# EAGLE design Fogger Sheild (EAGLE 6.4)
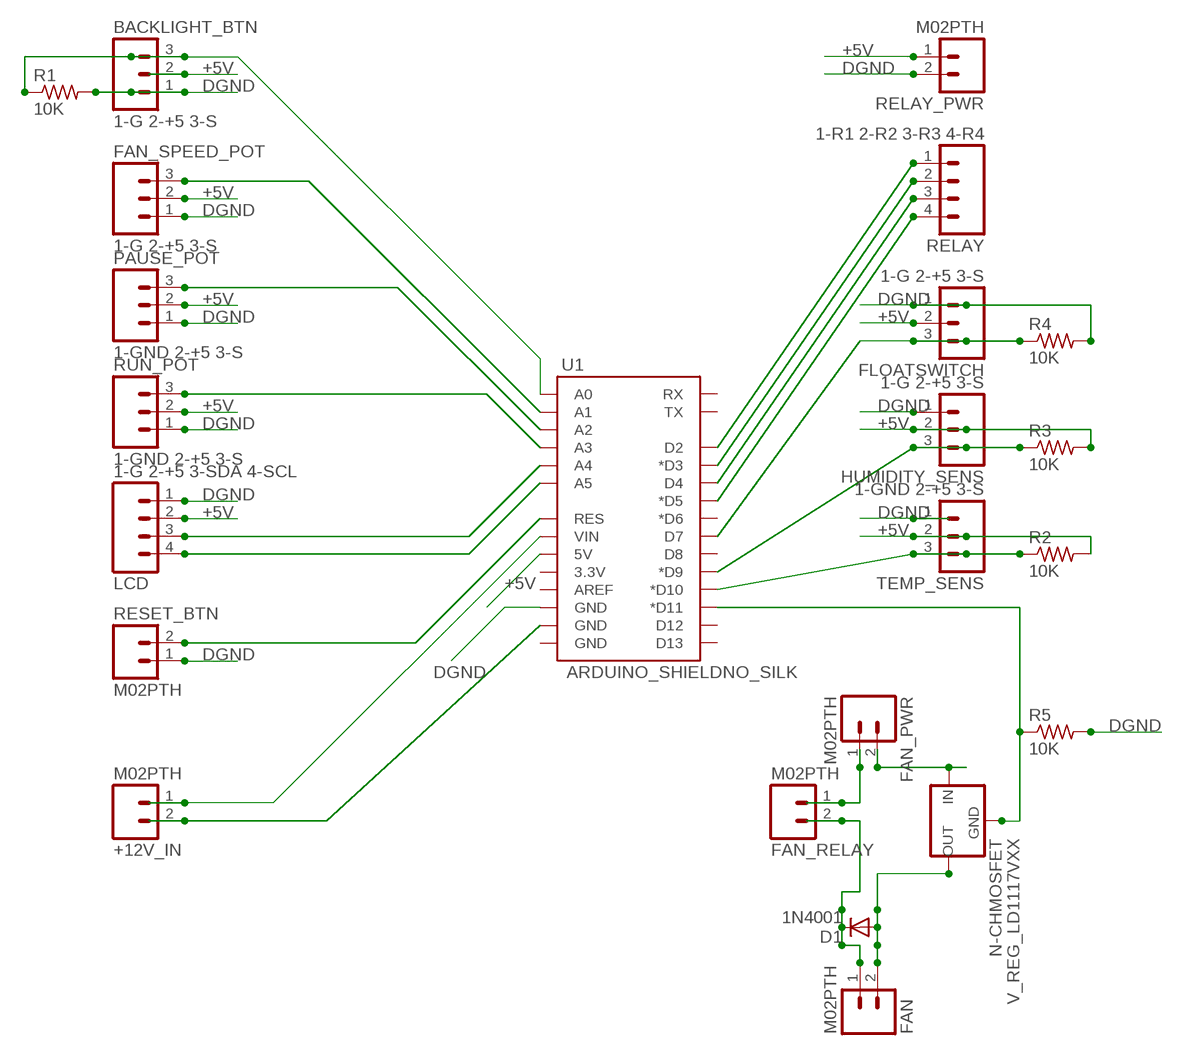
[diagram p0: schematic, sheet 1]

## Parts
+12V_IN  M02PTH  [1X02]
BACKLIGHT_BTN  1-G 2-+5 3-S  M03LOCK  [1X03_LOCK]
D1  1N4001  DIODEPTH  [DIODE-1N4001]
FAN  M02PTH  [1X02]
FAN_PWR  M02PTH  [1X02]
FAN_RELAY  M02PTH  [1X02]
FAN_SPEED_POT  1-G 2-+5 3-S  M03PTH  [1X03]
FLOATSWITCH  1-G 2-+5 3-S  M03LOCK  [1X03_LOCK]
HUMIDITY_SENS  1-G 2-+5 3-S  M03PTH  [1X03]
LCD  1-G 2-+5 3-SDA 4-SCL  M04PTH  [1X04]
N-CHMOSFET  V_REG_LD1117VXX  [78XXL]
PAUSE_POT  1-GND 2-+5 3-S  M03LOCK  [1X03_LOCK]
R1  10K  R-US_0204/5  [0204/5]
R2  10K  R-US_0204/2V  [0204V]
R3  10K  R-US_0204/2V  [0204V]
R4  10K  R-US_0204/5  [0204/5]
R5  10K  R-US_0204/2V  [0204V]
RELAY  1-R1 2-R2 3-R3 4-R4  M04PTH  [1X04]
RELAY_PWR  M02PTH  [1X02]
RESET_BTN  M02PTH  [1X02]
RUN_POT  1-GND 2-+5 3-S  M03PTH  [1X03]
TEMP_SENS  1-GND 2-+5 3-S  M03LOCK  [1X03_LOCK]
U1  ARDUINO_SHIELDNO_SILK  [DUEMILANOVE_VIAS]

## Nets
+5V: BACKLIGHT_BTN.2 FAN_SPEED_POT.2 FLOATSWITCH.2 HUMIDITY_SENS.2 LCD.2 PAUSE_POT.2 R2.2 R3.2 RELAY_PWR.1 RUN_POT.2 TEMP_SENS.2 U1.5V
DGND: BACKLIGHT_BTN.1 FAN_SPEED_POT.1 FLOATSWITCH.1 HUMIDITY_SENS.1 LCD.1 PAUSE_POT.1 R1.2 R4.2 R5.2 RELAY_PWR.2 RESET_BTN.1 RUN_POT.1 TEMP_SENS.1 U1.GND@2(GND)
N$1: RELAY.4 U1.D5(*D5)
N$2: RELAY.3 U1.D4
N$3: RELAY.2 U1.D3(*D3)
N$4: RELAY.1 U1.D2
N$5: LCD.3 U1.A4
N$6: LCD.4 U1.A5
N$7: RUN_POT.3 U1.A3
N$8: PAUSE_POT.3 U1.A2
N$9: FAN_SPEED_POT.3 U1.A1
N$10: +12V_IN.2 U1.GND@1(GND)
N$11: RESET_BTN.2 U1.RES
N$13: +12V_IN.1 U1.VIN
N$14: BACKLIGHT_BTN.3 R1.1 U1.A0
N$18: FLOATSWITCH.3 R4.1 U1.D7
N$19: HUMIDITY_SENS.3 R3.1 U1.D9(*D9)
N$23: R2.1 TEMP_SENS.3 U1.D10(*D10)
N$25: N-CHMOSFET.IN(GND) R5.1 U1.D11(*D11)
N$26: FAN_PWR.2 N-CHMOSFET.OUT(IN)
N$27: D1.A FAN.2 N-CHMOSFET.GND(OUT)
N$28: D1.C FAN.1 FAN_RELAY.2
N$29: FAN_PWR.1 FAN_RELAY.1
Unconnected: U1.3.3V U1.AREF U1.D6(*D6) U1.D8 U1.D12 U1.D13 U1.GND@0(GND) U1.RX U1.TX

## Library data of the parts
+12V_IN FAN FAN_PWR FAN_RELAY RELAY_PWR RESET_BTN = SparkFun-Connectors:M02: Standard 2-pin 0.1" header. Use with - straight break away headers ( PRT-00116) - right angle break away headers (PRT-00553) - swiss pins (PRT-00743) - machine pins (PRT-00117) - female headers (PRT-00115) Molex polarized connector foot print use with: PRT-08233 with associated crimp pins and housings. 2.54_SCREWTERM for use with PRT-10571. 3.5mm Screw Terminal footprints for PRT-08084 5mm Screw Terminal footprints for use with PRT-08433
BACKLIGHT_BTN FAN_SPEED_POT FLOATSWITCH HUMIDITY_SENS PAUSE_POT RUN_POT TEMP_SENS = SparkFun-Connectors:M03: Header 3 Standard 3-pin 0.1" header. Use with straight break away headers (SKU : PRT-00116), right angle break away headers (PRT-00553), swiss pins (PRT-00743), machine pins (PRT-00117), and female headers (PRT-00115). Molex polarized connector foot print use with SKU : PRT-08232 with associated crimp pins and housings.
D1 = SparkFun-DiscreteSemi:DIODE: Diode These are standard reverse protection diodes and small signal diodes. SMA package can handle up to about 1A. SOD-323 can handle about 200mA. What the SOD-323 package when ordering, there are some mfgs out there that are 5-pin packages.
LCD RELAY = SparkFun-Connectors:M04: Header 4 Standard 4-pin 0.1" header. Use with straight break away headers (SKU : PRT-00116), right angle break away headers (PRT-00553), swiss pins (PRT-00743), machine pins (PRT-00117), and female headers (PRT-00115). Molex polarized connector foot print use with SKU : PRT-08231 with associated crimp pins and housings. 1MM SMD Version SKU: PRT-10208
N-CHMOSFET = SparkFun-PowerIC:V_REG_LD1117VXX: LD1117VXX voltage regulator. We carry the 3.3V version (COM-00526) in TO-220 package.
R1-R5 = resistor:R-US_: RESISTOR, American symbol
U1 = SparkFun-Boards:ARDUINO_SHIELD: Arduino shield footprint

## Board
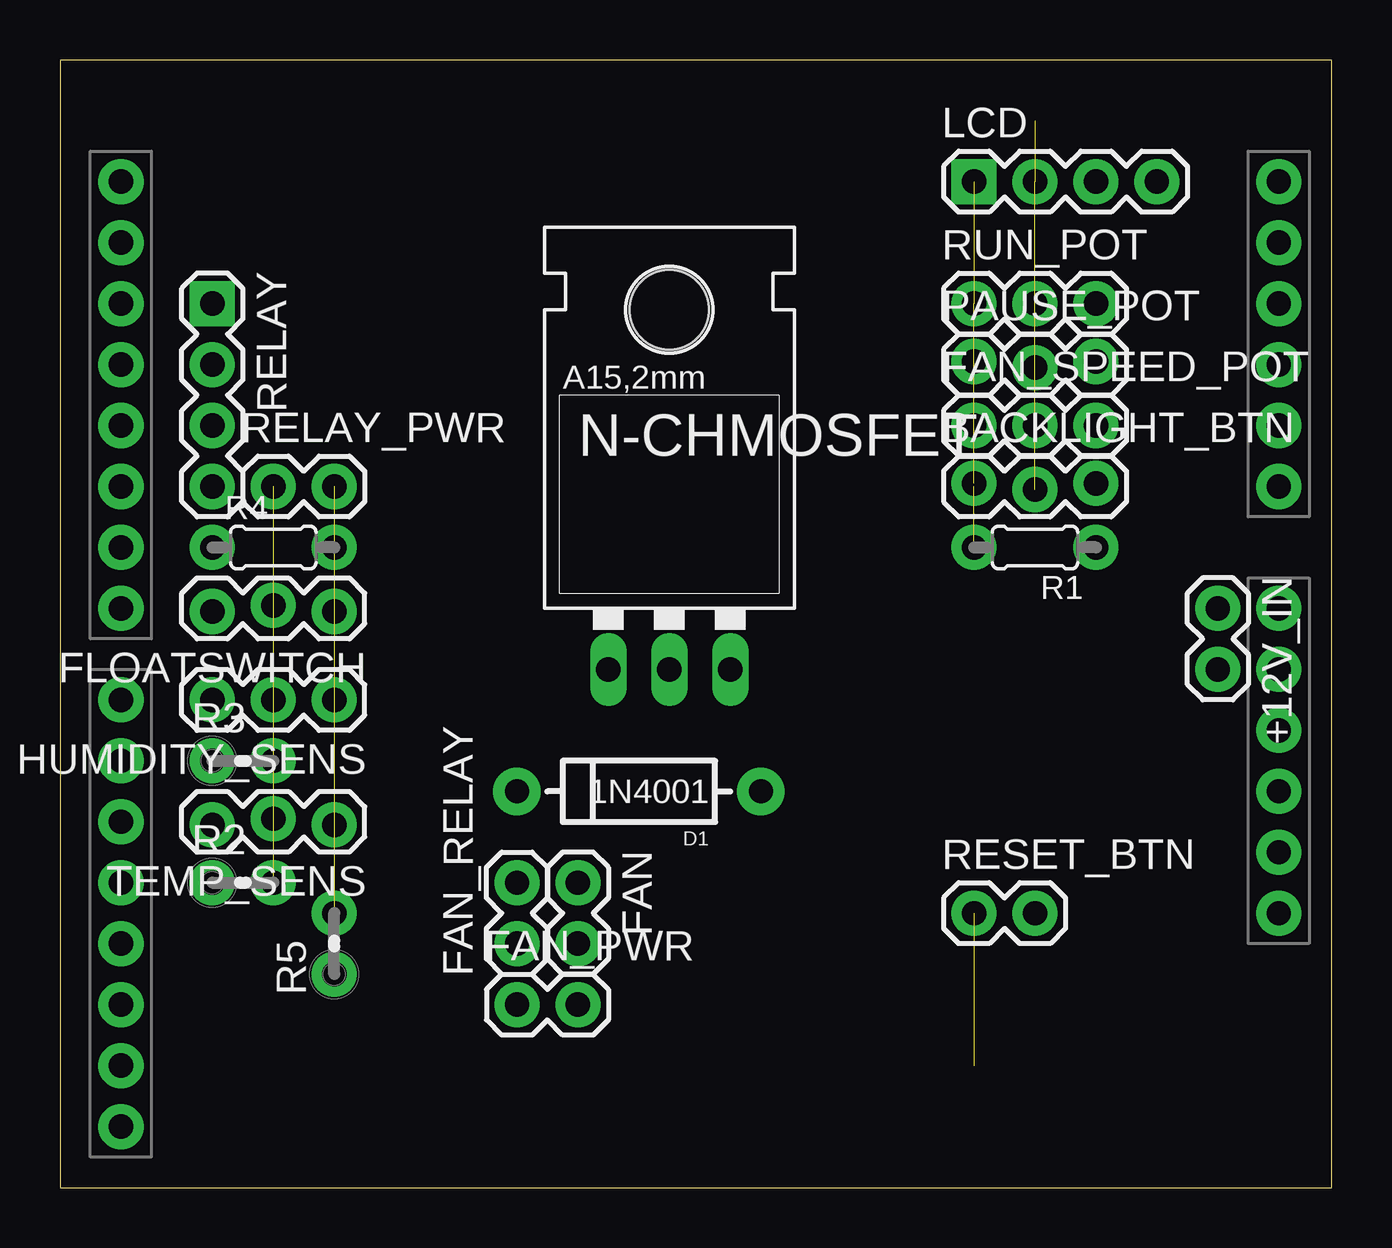
[diagram p1: board, top side]
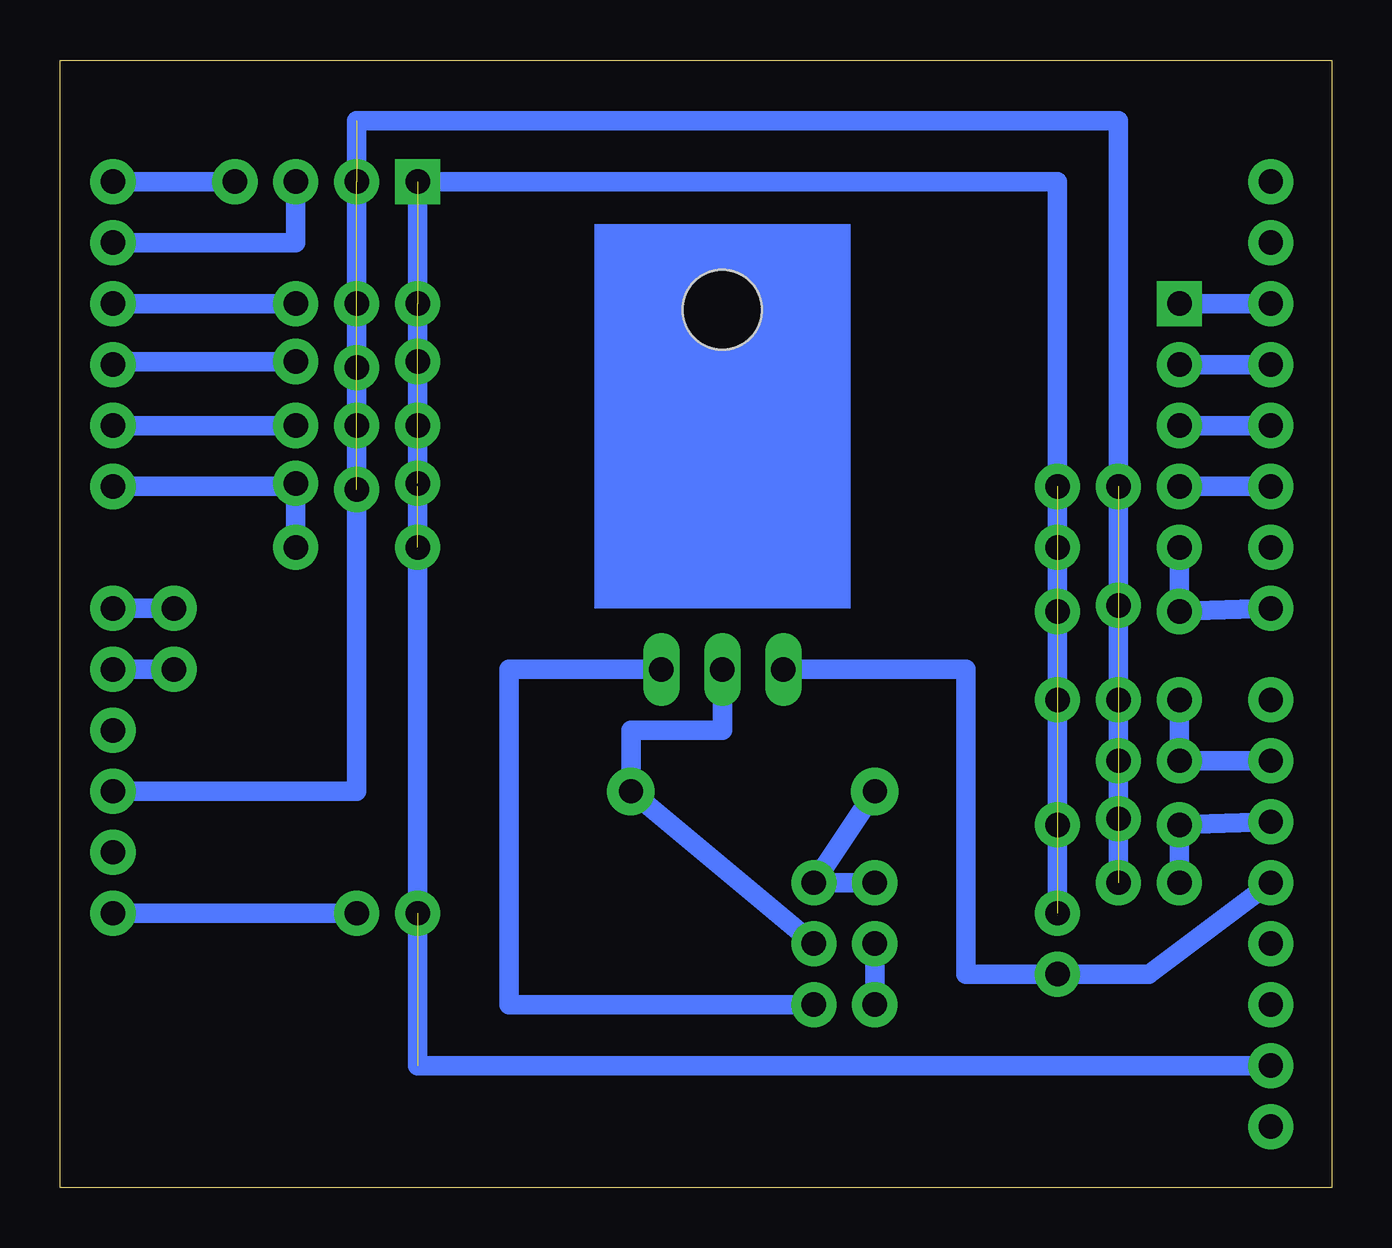
[diagram p2: board, bottom side, seen from below]

Size 53.01 x 46.98 mm. Coordinates in mm from the lower left corner, seen from the top.
Outline: 0,0 53.01,0 53.01,46.98 0,46.98 0,0
Copper layers (1*16): Top 0.035mm / dielectric 1.5mm / Bottom 0.035mm
Design rules "default": minimum track width 10mil, minimum drill 24mil, track to track 8mil, track to pad 8mil, pad to pad 8mil, via to via 8mil, smd to smd 8mil, copper to edge 40mil, drill to drill 8mil, minimum pad ring 10mil, minimum via ring 8mil, stop-mask expansion 4mil, vias tented up to drill 0mil, thermal gap 10mil

### Footprints (pad centres in the part's own frame; a part is rotated, then mirrored left to right if it is on the bottom)
1X02 = drill 1.016 pad 1.88: 1 0,0; 2 2.54,0
1X03_LOCK = drill 1.016 pad 1.88: 1 0,0.127; 2 2.54,-0.127; 3 5.08,0.127
DIODE-1N4001 = drill 1 pad 1.981: A -5.08,0; C 5.08,0
1X03 = drill 1.016 pad 1.88: 1 0,0; 2 2.54,0; 3 5.08,0
1X04 = drill 1.016 pad 1.88 square: 1 0,0 | drill 1.016 pad 1.88: 2 2.54,0; 3 5.08,0; 4 7.62,0
78XXL = drill 1.016 long: GND 0,-3.81; IN -2.54,-3.81; OUT 2.54,-3.81 | hole 3.302: 0,11.176
0204/5 = drill 1.016 pad 1.88: 1 -2.54,0; 2 2.54,0
0204V = drill 1.016 pad 1.88: 1 -1.27,0; 2 1.27,0
DUEMILANOVE_VIAS = drill 1.016 pad 1.88: 3.3V 50.8,13.97; 5V 50.8,16.51; A0 50.8,29.21; A1 50.8,31.75; A2 50.8,34.29; A3 50.8,36.83; A4 50.8,39.37; A5 50.8,41.91; AREF 2.54,2.54; D2 2.54,36.83; D3 2.54,34.29; D4 2.54,31.75; D5 2.54,29.21; D6 2.54,26.67; D7 2.54,24.13; D8 2.54,20.32; D9 2.54,17.78; D10 2.54,15.24; D11 2.54,12.7; D12 2.54,10.16; D13 2.54,7.62; GND@0 50.8,19.05; GND@1 50.8,21.59; GND@2 2.54,5.08; RES 50.8,11.43; RX 2.54,41.91; TX 2.54,39.37; VIN 50.8,24.13

### Placement (x,y rotation side)
+12V_IN  48.26,24.13 270 top
BACKLIGHT_BTN  38.1,29.21 0 top
D1  24.13,16.51 180 top
FAN  21.59,12.7 270 top
FAN_PWR  19.05,7.62 0 top
FAN_RELAY  19.05,10.16 90 top
FAN_SPEED_POT  38.1,31.75 0 top
FLOATSWITCH  11.43,24.13 180 top
HUMIDITY_SENS  11.43,20.32 180 top
LCD  38.1,41.91 0 top
N-CHMOSFET  25.4,25.4 0 top
PAUSE_POT  38.1,34.29 0 top
R1  40.64,26.67 180 top
R2  7.62,12.7 0 top
R3  7.62,17.78 0 top
R4  8.89,26.67 0 top
R5  11.43,10.16 90 top
RELAY  6.35,36.83 270 top
RELAY_PWR  8.89,29.21 0 top
RESET_BTN  38.1,11.43 0 top
RUN_POT  38.1,36.83 0 top
TEMP_SENS  11.43,15.24 180 top
U1  0,0 0 top

### Tracks (layer width: path | path; a pad name or v marks a point on that pad's centre or on a via)
+5V  (10 unrouted)
  Bottom 0.813: U1.5V 40.64,16.51 40.64,44.45 8.89,44.45 R2.2
DGND  (11 unrouted)
  Bottom 0.254: BACKLIGHT_BTN.1 38.1,29.21
  Bottom 0.813: R5.2 11.43,41.91 LCD.1 38.1,5.08 U1.GND@2
N$1
  Bottom 0.813: RELAY.4 U1.D5
N$2
  Bottom 0.813: RELAY.3 U1.D4
N$3
  Bottom 0.813: RELAY.2 U1.D3
N$4
  Bottom 0.813: RELAY.1 U1.D2
N$5
  Bottom 0.813: U1.A4 43.18,39.37 LCD.3
N$6
  Bottom 0.813: U1.A5 LCD.4
N$7
  Bottom 0.813: U1.A3 RUN_POT.3
N$8
  Bottom 0.254: U1.A2 50.8,34.42
  Bottom 0.813: 50.8,34.42 PAUSE_POT.3
N$9
  Bottom 0.813: U1.A1 FAN_SPEED_POT.3
N$10
  Bottom 0.813: U1.GND@1 +12V_IN.2
N$11
  Bottom 0.813: U1.RES RESET_BTN.2
N$13
  Bottom 0.813: U1.VIN +12V_IN.1
N$14
  Bottom 0.254: U1.A0 50.67,29.34
  Bottom 0.813: U1.A0 43.18,29.21 BACKLIGHT_BTN.3 R1.1
N$18
  Bottom 0.254: FLOATSWITCH.3 6.35,24.13
  Bottom 0.813: U1.D7 FLOATSWITCH.3 R4.1
N$19
  Bottom 0.813: U1.D9 R3.1 HUMIDITY_SENS.3
N$23
  Bottom 0.813: R2.1 TEMP_SENS.3 U1.D10
N$25
  Bottom 0.813: U1.D11 7.62,8.89 R5.1 15.24,8.89 15.24,21.59 N-CHMOSFET.IN
N$26
  Bottom 0.813: N-CHMOSFET.OUT 34.29,21.59 34.29,7.62 FAN_PWR.2
N$27
  Bottom 0.813: FAN.2 D1.A 29.21,19.05 25.4,19.05 N-CHMOSFET.GND
N$28
  Bottom 0.813: FAN_RELAY.2 FAN.1 D1.C
N$29
  Bottom 0.813: FAN_RELAY.1 FAN_PWR.1
(copper drawn outside any net)
  shapes: Bottom area x11, Bottom circle x1